# Altium schematic sheet 2019-NUC029LAN.SchDoc
size A3
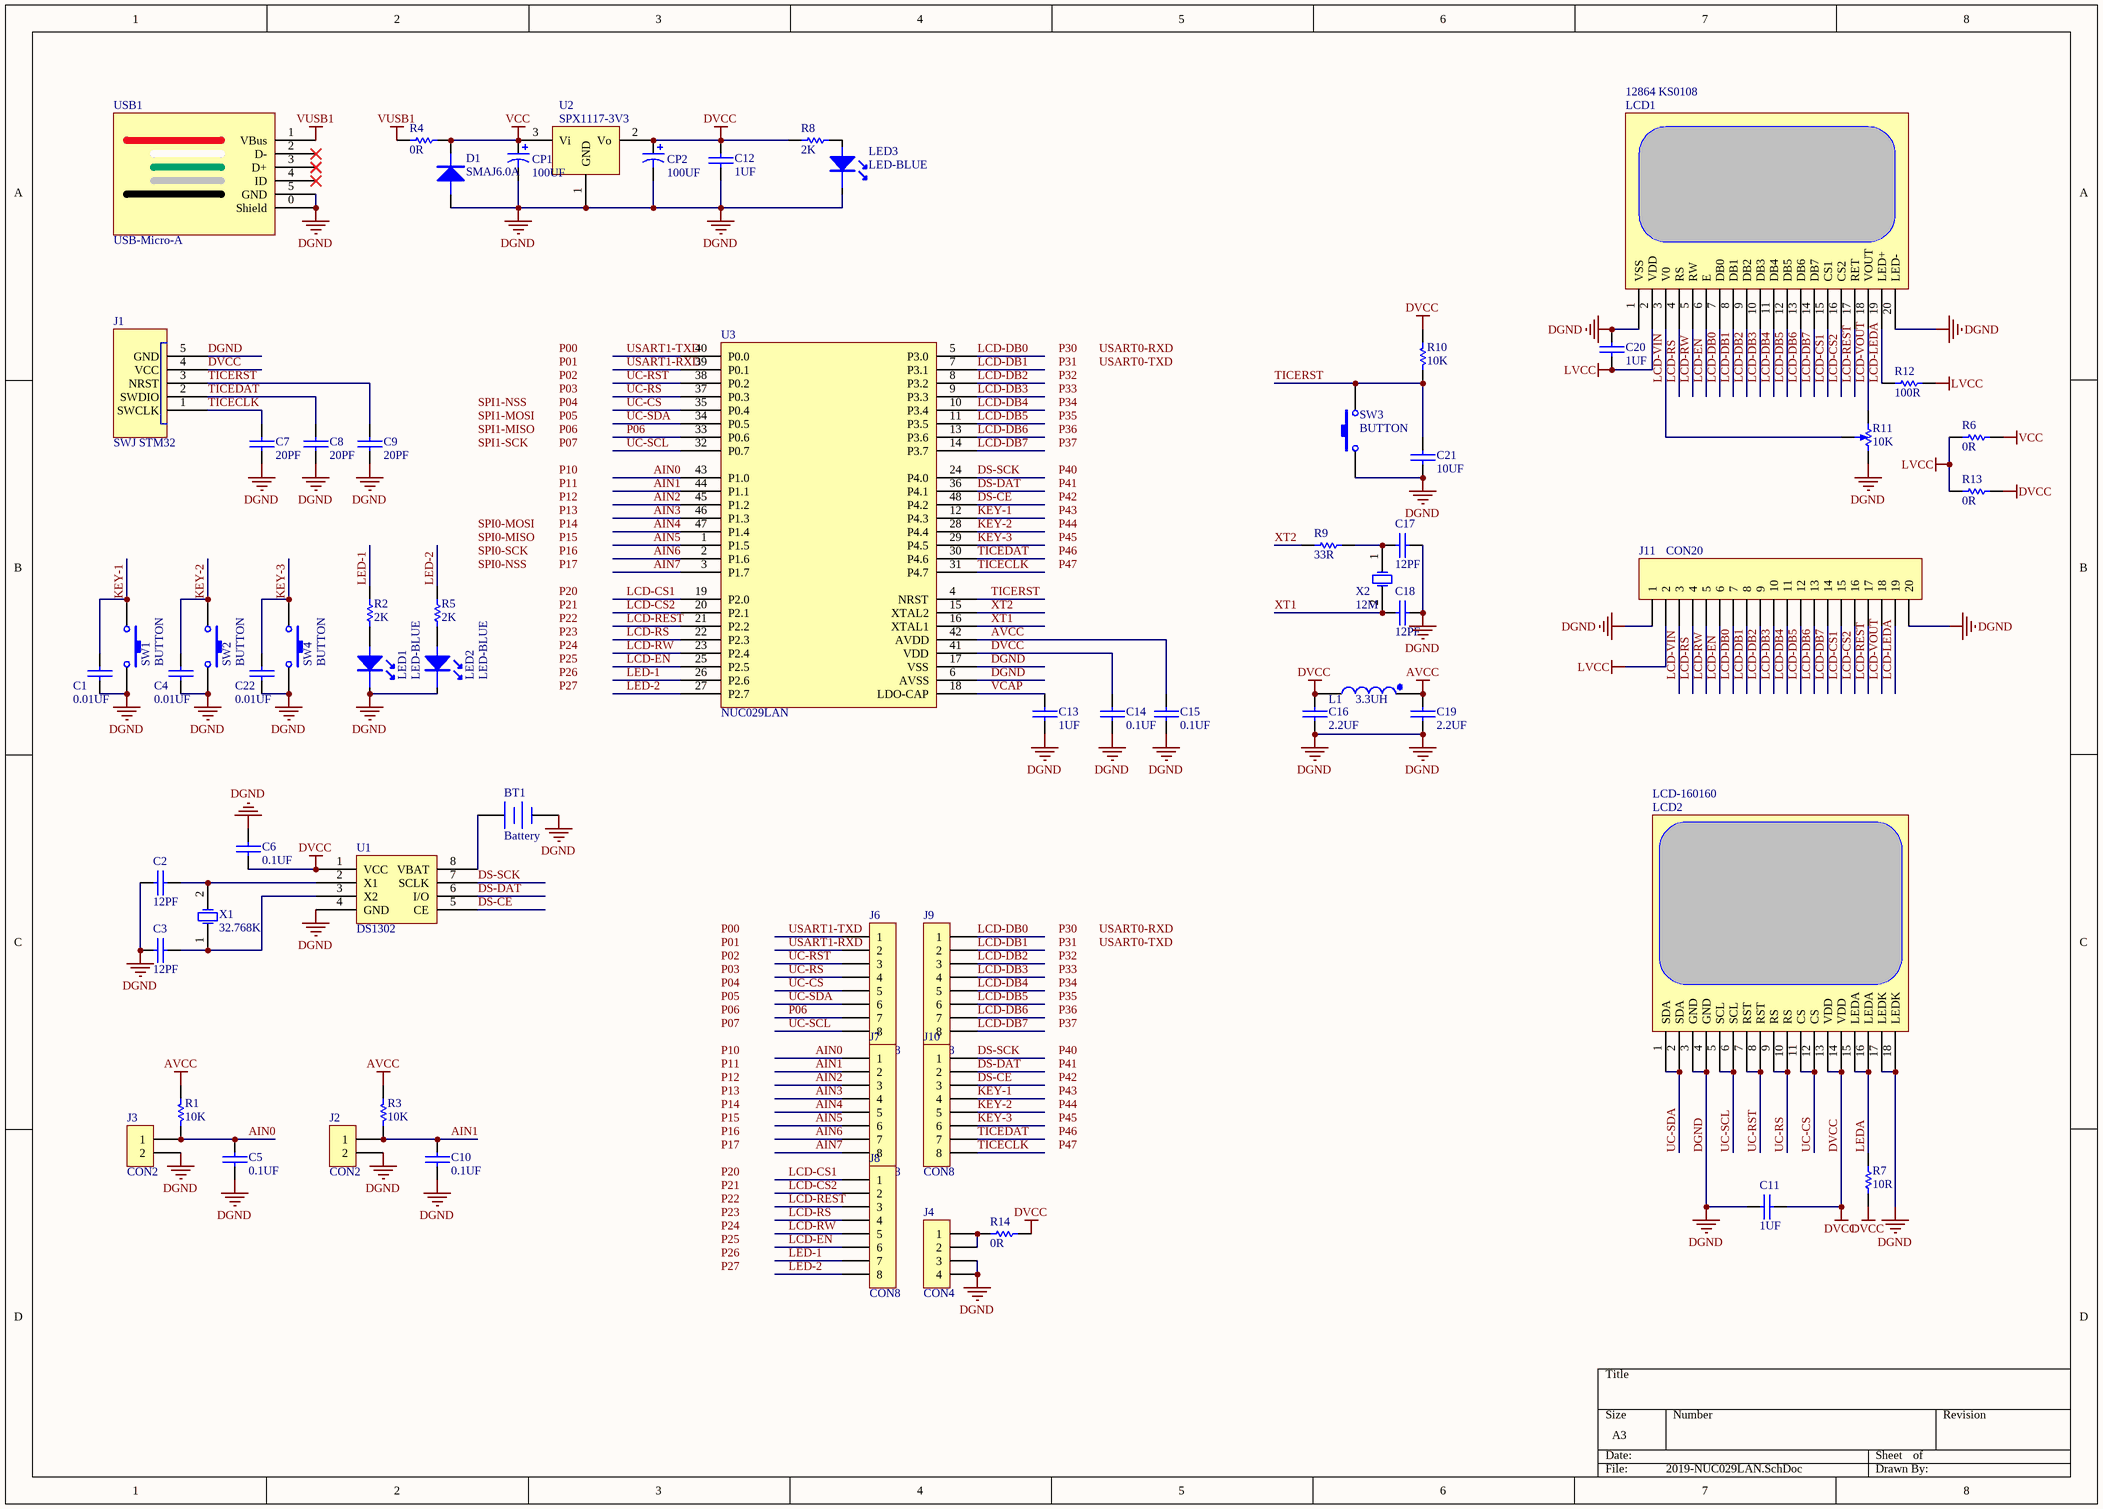
[diagram p0: 2019-NUC029LAN.SchDoc]

## Parts
BT1  Battery  [cr1200]
C1  0.01UF  [LC-0603-C]
C2  12PF  [LC-0603-C]
C3  12PF  [LC-0603-C]
C4  0.01UF  [LC-0603-C]
C5  0.1UF  [LC-0603-C]
C6  0.1UF  [LC-0603-C]
C7  20PF  [LC-0603-C]
C8  20PF  [LC-0603-C]
C9  20PF  [LC-0603-C]
C10  0.1UF  [LC-0603-C]
C11  1UF  [lc-0805-c]
C12  1UF  [lc-0805-c]
C13  1UF  [LC-0603-C]
C14  0.1UF  [LC-0603-C]
C15  0.1UF  [LC-0603-C]
C16  2.2UF  [LC-0603-C]
C17  12PF  [LC-0603-C]
C18  12PF  [LC-0603-C]
C19  2.2UF  [LC-0603-C]
C20  1UF  [lc-0805-c]
C21  10UF  [LC-0603-C]
C22  0.01UF  [LC-0603-C]
CP1  100UF  [LC-CASE-B_3528]
CP2  100UF  [LC-CASE-B_3528]
D1  SMAJ6.0A  [LC-SMA(DO-214AC)_S3]
J1  SWJ STM32  [ICD2]
J2  CON2  [lc-0805-L]
J3  CON2  [lc-0805-L]
J4  CON4  [sip-4]
J6  CON8  [sip-8]
J7  CON8  [sip-8]
J8  CON8  [sip-8]
J9  CON8  [sip-8]
J10  CON8  [sip-8]
J11  CON20  [sip-20]
L1  3.3UH  [lc-0805-L]
LCD1  12864 KS0108  [12864 ks0108]
LCD2  LCD-160160  [lcd-160160]
LED1  LED-BLUE  [LC-0805-LED]
LED2  LED-BLUE  [LC-0805-LED]
LED3  LED-BLUE  [LC-0805-LED]
R1  10K  [LC-0603-R]
R2  2K  [LC-0603-R]
R3  10K  [LC-0603-R]
R4  0R  [lc-0805-l]
R5  2K  [LC-0603-R]
R6  0R  [lc-0805-l]
R7  10R  [lc-0805-r]
R8  2K  [LC-0603-R]
R9  33R  [LC-0603-R]
R10  10K  [LC-0603-R]
R11  10K  [dwq-4]
R12  100R  [lc-0805-r]
R13  0R  [lc-0805-l]
R14  0R  [lc-0805-l]
SW1  BUTTON  [button-c]
SW2  BUTTON  [button-c]
SW3  BUTTON  [button5]
SW4  BUTTON  [button-c]
U1  DS1302  [stc-dip8]
U2  SPX1117-3V3  [lc-SOT-223]
U3  NUC029LAN  [LC-LQFP-48_7x7x05P]
USB1  USB-Micro-A  [USB-MICRO-R]
X1  32.768K  [xl-2]
X2  12M  [xl-1]

## Nets
AVCC: C15.2 C19.2 L1.1 R1.1 R3.1 U3.42(AVDD)
DGND: BT1.2(-) C1.1 C2.1 C3.1 C4.1 C5.1 C6.2 C7.1 C8.1 C9.1 C10.1 C11.1 C12.2 C13.2 C14.1 C15.1 C16.2 C17.2 C18.2 C19.1 C20.1 C21.2 C22.1 CP1.2 CP2.2 D1.1 J1.5(GND) J2.2 J3.2 J4.3 J4.4 J11.1 J11.20 LCD1.1(VSS) LCD1.20(LED-) LCD2.3(GND) LCD2.4(GND) LCD2.17(LEDK) LCD2.18(LEDK) LED1.K LED2.K LED3.K R11.1 SW1.1 SW2.1 SW3.1 SW4.1 U1.4(GND) U2.1(GND) U3.6(AVSS) U3.17(VSS) USB1.0(Shield) USB1.5(GND)
DVCC: C6.1 C11.2 C12.1 C14.2 C16.1 CP2.1 J1.4(VCC) L1.2 LCD2.13(VDD) LCD2.14(VDD) R7.1 R8.2 R10.1 R13.2 R14.2 U1.1(VCC) U2.2(Vo) U3.41(VDD)
LVCC: C20.2 J11.2 LCD1.2(VDD) R6.1 R12.2 R13.1
VCC: CP1.1 D1.2 R4.2 R6.2 U2.3(Vi)
VUSB1: R4.1 USB1.1(VBus)
AIN0: C5.2 J3.1 J7.1 R1.2 U3.43(P1.0)
AIN1: C10.2 J2.1 J7.2 R3.2 U3.44(P1.1)
AIN2: J7.3 U3.45(P1.2)
AIN3: J7.4 U3.46(P1.3)
AIN4: J7.5 U3.47(P1.4)
AIN5: J7.6 U3.1(P1.5)
AIN6: J7.7 U3.2(P1.6)
AIN7: J7.8 U3.3(P1.7)
DS-CE: J10.3 U1.5(CE) U3.48(P4.2)
DS-DAT: J10.2 U1.6(I/O) U3.36(P4.1)
DS-SCK: J10.1 U1.7(SCLK) U3.24(P4.0)
KEY-1: C1.2 J10.4 SW1.2 U3.12(P4.3)
KEY-2: C4.2 J10.5 SW2.2 U3.28(P4.4)
KEY-3: C22.2 J10.6 SW4.2 U3.29(P4.5)
LCD-CS1: J8.1 J11.15 LCD1.15(CS1) U3.19(P2.0)
LCD-CS2: J8.2 J11.16 LCD1.16(CS2) U3.20(P2.1)
LCD-DB0: J9.1 J11.7 LCD1.7(DB0) U3.5(P3.0)
LCD-DB1: J9.2 J11.8 LCD1.8(DB1) U3.7(P3.1)
LCD-DB2: J9.3 J11.9 LCD1.9(DB2) U3.8(P3.2)
LCD-DB3: J9.4 J11.10 LCD1.10(DB3) U3.9(P3.3)
LCD-DB4: J9.5 J11.11 LCD1.11(DB4) U3.10(P3.4)
LCD-DB5: J9.6 J11.12 LCD1.12(DB5) U3.11(P3.5)
LCD-DB6: J9.7 J11.13 LCD1.13(DB6) U3.13(P3.6)
LCD-DB7: J9.8 J11.14 LCD1.14(DB7) U3.14(P3.7)
LCD-EN: J8.6 J11.6 LCD1.6(E) U3.25(P2.5)
LCD-LEDA: J11.19 LCD1.19(LED+) R12.1
LCD-REST: J8.3 J11.17 LCD1.17(RET) U3.21(P2.2)
LCD-RS: J8.4 J11.4 LCD1.4(RS) U3.22(P2.3)
LCD-RW: J8.5 J11.5 LCD1.5(RW) U3.23(P2.4)
LCD-VIN: J11.3 LCD1.3(V0) R11.3
LCD-VOUT: J11.18 LCD1.18(VOUT) R11.2
LED-1: J8.7 R2.1 U3.26(P2.6)
LED-2: J8.8 R5.1 U3.27(P2.7)
LEDA: LCD2.15(LEDA) LCD2.16(LEDA) R7.2
P06: J6.7 U3.33(P0.6)
TICECLK: C7.2 J1.1(SWCLK) J10.8 U3.31(P4.7)
TICEDAT: C8.2 J1.2(SWDIO) J10.7 U3.30(P4.6)
TICERST: C9.2 C21.1 J1.3(NRST) R10.2 SW3.2 U3.4(NRST)
UC-CS: J6.5 LCD2.11(CS) LCD2.12(CS) U3.35(P0.4)
UC-RS: J6.4 LCD2.9(RS) LCD2.10(RS) U3.37(P0.3)
UC-RST: J6.3 LCD2.7(RST) LCD2.8(RST) U3.38(P0.2)
UC-SCL: J6.8 LCD2.5(SCL) LCD2.6(SCL) U3.32(P0.7)
UC-SDA: J6.6 LCD2.1(SDA) LCD2.2(SDA) U3.34(P0.5)
USART1-RXD: J6.2 U3.39(P0.1)
USART1-TXD: J6.1 U3.40(P0.0)
VCAP: C13.1 U3.18(LDO-CAP)
XT1: C18.1 U3.16(XTAL1) X2.2
XT2: R9.1 U3.15(XTAL2)
NetBT1_1: BT1.1(+) U1.8(VBAT)
NetC2_2: C2.2 U1.2(X1) X1.2
NetC3_2: C3.2 U1.3(X2) X1.1
NetC17_1: C17.1 R9.2 X2.1
NetJ4_1: J4.1 J4.2 R14.1
NetLED1_A: LED1.A R2.2
NetLED2_A: LED2.A R5.2
NetLED3_A: LED3.A R8.1

Not connected (* = marked no-connect by the designer): USB1 2(D-)* 3(D+)* 4(ID)*

## Notes on the sheet
- Labels drawn without touching a wire or pin: P00, P01, P02, P03, P04, P05, P06, P07, P10, P11, P12, P13, P14, P15, P16, P17, P20, P21, P22, P23, P24, P25, P26, P27, P30, P31, P32, P33, P34, P35, P36, P37, P40, P41, P42, P43, P44, P45, P46, P47, SPI0-MISO, SPI0-MOSI, SPI0-NSS, SPI0-SCK, SPI1-MISO, SPI1-MOSI, SPI1-NSS, SPI1-SCK, USART0-RXD, USART0-TXD

## Library data of the parts
BT1 = Battery: Multicell Battery; Published: 24-Mar-1999; LatestRevisionDate: 17-Jul-2002; LatestRevisionNote: Re-released for DXP Platform.; PackageReference: BAT-2; Publisher: Altium Limited
C1-C22 = CAP
CP1 CP2 = CAP1
D1 = DIODE
J1 = SWJ
J2 J3 = CON2: Connector
J4 = CON4: Connector
J6-J10 = CON8: Connector
J11 = CON20: Connector
L1 = INDUCTOR
LED1-LED3 = LED
R1-R10 R12-R14 = RES
R11 = RES-ADJ
U2 = AMS1117
X1 X2 = JZ